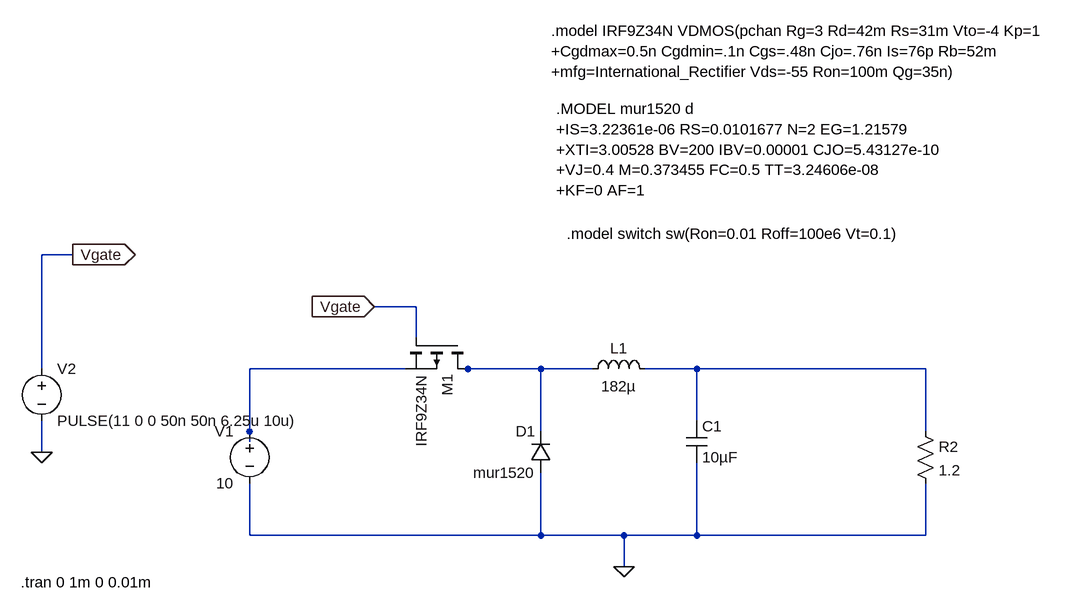
[diagram p0: schematic Buck.asc]
Buck.asc, the LTspice schematic file:
Version 4
SHEET 1 1004 680
WIRE -560 32 -608 32
WIRE -32 112 -96 112
WIRE -32 160 -32 112
WIRE -608 208 -608 32
WIRE -48 208 -288 208
WIRE 48 208 32 208
WIRE 160 208 48 208
WIRE 240 208 160 208
WIRE 400 208 320 208
WIRE 752 208 400 208
WIRE 400 288 400 208
WIRE -288 304 -288 208
WIRE 160 304 160 208
WIRE 752 304 752 208
WIRE -288 320 -288 304
WIRE -608 336 -608 288
WIRE -288 464 -288 384
WIRE 160 464 160 368
WIRE 160 464 -288 464
WIRE 288 464 160 464
WIRE 400 464 400 352
WIRE 400 464 288 464
WIRE 752 464 752 384
WIRE 752 464 400 464
WIRE 288 512 288 464
FLAG 288 512 0
FLAG -608 336 0
FLAG -560 32 Vgate
IOPIN -560 32 Out
FLAG -96 112 Vgate
IOPIN -96 112 In
SYMBOL voltage -288 288 M0
SYMATTR InstName V1
SYMATTR Value 10
SYMBOL cap 384 288 R0
SYMATTR InstName C1
SYMATTR Value 10µF
SYMBOL res 736 288 R0
SYMATTR InstName R2
SYMATTR Value 1.2
SYMBOL ind 224 224 R270
WINDOW 0 32 56 VTop 2
WINDOW 3 5 56 VBottom 2
SYMATTR InstName L1
SYMATTR Value 182µ
SYMBOL diode 176 368 R180
WINDOW 0 24 64 Left 2
WINDOW 3 24 0 Left 2
SYMATTR InstName D1
SYMATTR Value mur1520
SYMBOL pmos 48 160 R90
SYMATTR InstName M1
SYMATTR Value IRF9Z34N
SYMBOL voltage -608 192 R0
WINDOW 123 0 0 Left 0
WINDOW 39 0 0 Left 0
SYMATTR InstName V2
SYMATTR Value PULSE(11 0 0 50n 50n 6.25u 10u)
TEXT 200 0 Left 2 !.model switch sw(Ron=0.01 Roff=100e6 Vt=0.1)
TEXT 184 -192 Left 2 !.MODEL mur1520 d\n+IS=3.22361e-06 RS=0.0101677 N=2 EG=1.21579\n+XTI=3.00528 BV=200 IBV=0.00001 CJO=5.43127e-10\n+VJ=0.4 M=0.373455 FC=0.5 TT=3.24606e-08\n+KF=0 AF=1
TEXT 176 -312 Left 2 !.model IRF9Z34N VDMOS(pchan Rg=3 Rd=42m Rs=31m Vto=-4 Kp=1 \n+Cgdmax=0.5n Cgdmin=.1n Cgs=.48n Cjo=.76n Is=76p Rb=52m \n+mfg=International_Rectifier Vds=-55 Ron=100m Qg=35n)
TEXT -640 536 Left 2 !.tran 0 1m 0 0.01m

The netlist it stands for:
* Buck.asc
V1 N001 0 10
C1 N003 0 10µF
R2 N003 0 1.2
L1 N002 N003 182µ
D1 0 N002 mur1520
M1 N002 Vgate N001 N001 IRF9Z34N
V2 Vgate 0 PULSE(11 0 0 50n 50n 6.25u 10u)
.model D D
.lib standard.dio
.model NMOS NMOS
.model PMOS PMOS
.lib standard.mos
.model switch sw(Ron=0.01 Roff=100e6 Vt=0.1)
.MODEL mur1520 d
+IS=3.22361e-06 RS=0.0101677 N=2 EG=1.21579
+XTI=3.00528 BV=200 IBV=0.00001 CJO=5.43127e-10
+VJ=0.4 M=0.373455 FC=0.5 TT=3.24606e-08
+KF=0 AF=1
.model IRF9Z34N VDMOS(pchan Rg=3 Rd=42m Rs=31m Vto=-4 Kp=1
+Cgdmax=0.5n Cgdmin=.1n Cgs=.48n Cjo=.76n Is=76p Rb=52m
+mfg=International_Rectifier Vds=-55 Ron=100m Qg=35n)
.tran 0 1m 0 0.01m
.backanno
.end